# Altium schematic sheet Sheet1.SchDoc
size A
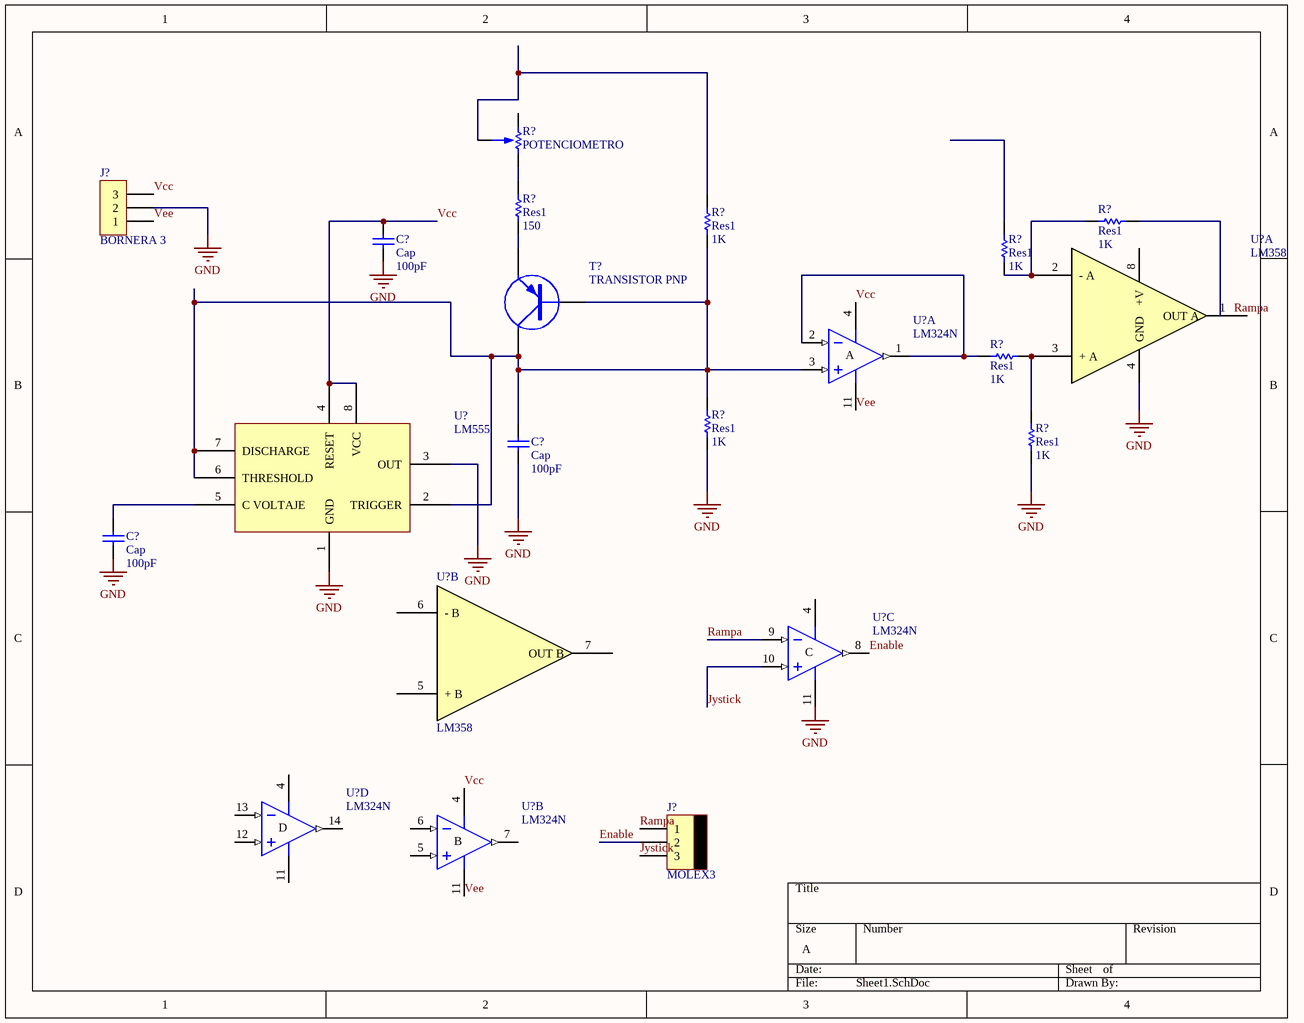
[diagram p0: Sheet1.SchDoc]

## Parts
(Parts that share a designator on the sheet are numbered #1, #2 ... from top to bottom, then left to right.)
C?#1  Cap  value 100pF  [RAD-0.3]
C?#2  Cap  value 100pF  [RAD-0.3]
C?#3  Cap  value 100pF  [RAD-0.3]
J?#1  BORNERA 3  [BORNERA3]
J?#2  MOLEX3  [MOLEX3]
R?#1  POTENCIOMETRO  [POTENCIOMETRO]
R?#2  Res1  value 150  [AXIAL-0.3]
R?#3  Res1  value 1K  [AXIAL-0.3]
R?#4  Res1  value 1K  [AXIAL-0.3]
R?#5  Res1  value 1K  [AXIAL-0.3]
R?#6  Res1  value 1K  [AXIAL-0.3]
R?#7  Res1  value 1K  [AXIAL-0.3]
R?#8  Res1  value 1K  [AXIAL-0.3]
T?  TRANSISTOR PNP  [TO92]
U?#1  LM358  [DIP8]  (part A of 2)
U?#2  LM324N  [N014]  (part A of 4)
U?#3  LM555  [DIP8]
U?#4  LM324N  [N014]  (part C of 4)
U?#5  LM358  [DIP8]  (part B of 2)
U?#6  LM324N  [N014]  (part D of 4)
U?#7  LM324N  [N014]  (part B of 4)

## Nets
GND: C?#1.1 C?#2.1 C?#3.1 J?#1.2 R?#7.1 R?#8.1 U?#1.4(GND) U?#3.1(GND) U?#3.3(OUT) U?#4.11(V-)
Enable: J?#2.2 U?#4.8(OUT)
Jystick: J?#2.3 U?#4.10(IN+)
Rampa: J?#2.1 U?#4.9(IN-)
Vcc: C?#1.2 J?#1.3 U?#2.4(V+) U?#3.4(RESET) U?#3.8(VCC) U?#7.4(V+)
Vee: J?#1.1 U?#2.11(V-) U?#7.11(V-)
NetC?#2_2: C?#2.2 R?#3.1 R?#7.2 T?.1(B) T?.2(C) U?#2.3(IN+) U?#3.2(TRIGGER) U?#3.6(THRESHOLD) U?#3.7(DISCHARGE)
NetC?#3_2: C?#3.2 U?#3.5(C_VOLTAJE)
NetR?#1_1: R?#1.1 R?#2.2
NetR?#1_2: R?#1.2 R?#3.2
NetR?#2_1: R?#2.1 T?.3(E)
NetR?#4_2: R?#4.2 R?#5.1 U?#1.2(-_A)
NetR?#6_1: R?#6.1 R?#8.2 U?#1.3(+_A)
NetR?#6_2: R?#6.2 U?#2.1(OUT) U?#2.2(IN-)

Not connected (* = marked no-connect by the designer): R?#1 3; R?#4 1; R?#5 2; U?#1 1(OUT_A) 8(+V); U?#4 4(V+); U?#5 5(+_B) 6(-_B) 7(OUT_B); U?#6 4(V+) 11(V-) 12(IN+) 13(IN-) 14(OUT); U?#7 5(IN+) 6(IN-) 7(OUT)

## Notes on the sheet
- Labels drawn without touching a wire or pin: Rampa
- (in symbol LM324N, part A) A
- (in symbol LM324N, part B) B
- (in symbol LM324N, part C) C
- (in symbol LM324N, part D) D

## Library data of the parts
C?#1-C?#3 = Cap: Capacitor; Published: 8-Jun-2000; LatestRevisionDate: 17-Jul-2002; LatestRevisionNote: Re-released for DXP Platform.; PackageReference: RAD-0.3; Publisher: Altium Limited; PackageDescription: Radial Cap, Thru-Hole; 2 Leads; 0.3 in Pin Spacing
R?#2-R?#8 = Res1: Resistor; Published: 8-Jun-2000; LatestRevisionDate: 17-Jul-2002; LatestRevisionNote: Re-released for DXP Platform.; PackageReference: AXIAL-0.3; Publisher: Altium Limited; PackageDescription: Axial Device, Thru-Hole; 2 Leads; 0.3 in Pin Spacing
U?#2 U?#4 U?#6 U?#7 = LM324N: Quadruple Operational Amplifier; Published: 16-Jan-2001; LatestRevisionDate: 04-Mar-2005; LatestRevisionNote: Stylized 3D Model Added.; DatasheetVersion: Feb-1997; PackageVersion: Oct-1995; PackageReference: N014; Publisher: Altium Limited; PackageDescription: DIP; 14 Leads; Row Spacing 7.62 mm; Pitch 2.54 mm; ComponentLink1Description: Manufacturer Link; ComponentLink1URL: http://www.ti.com/; ComponentLink2Description: Datasheet; ComponentLink2URL: http://www-s.ti.com/sc/ds/lm324.pdf
U?#3 = LM555: Timer